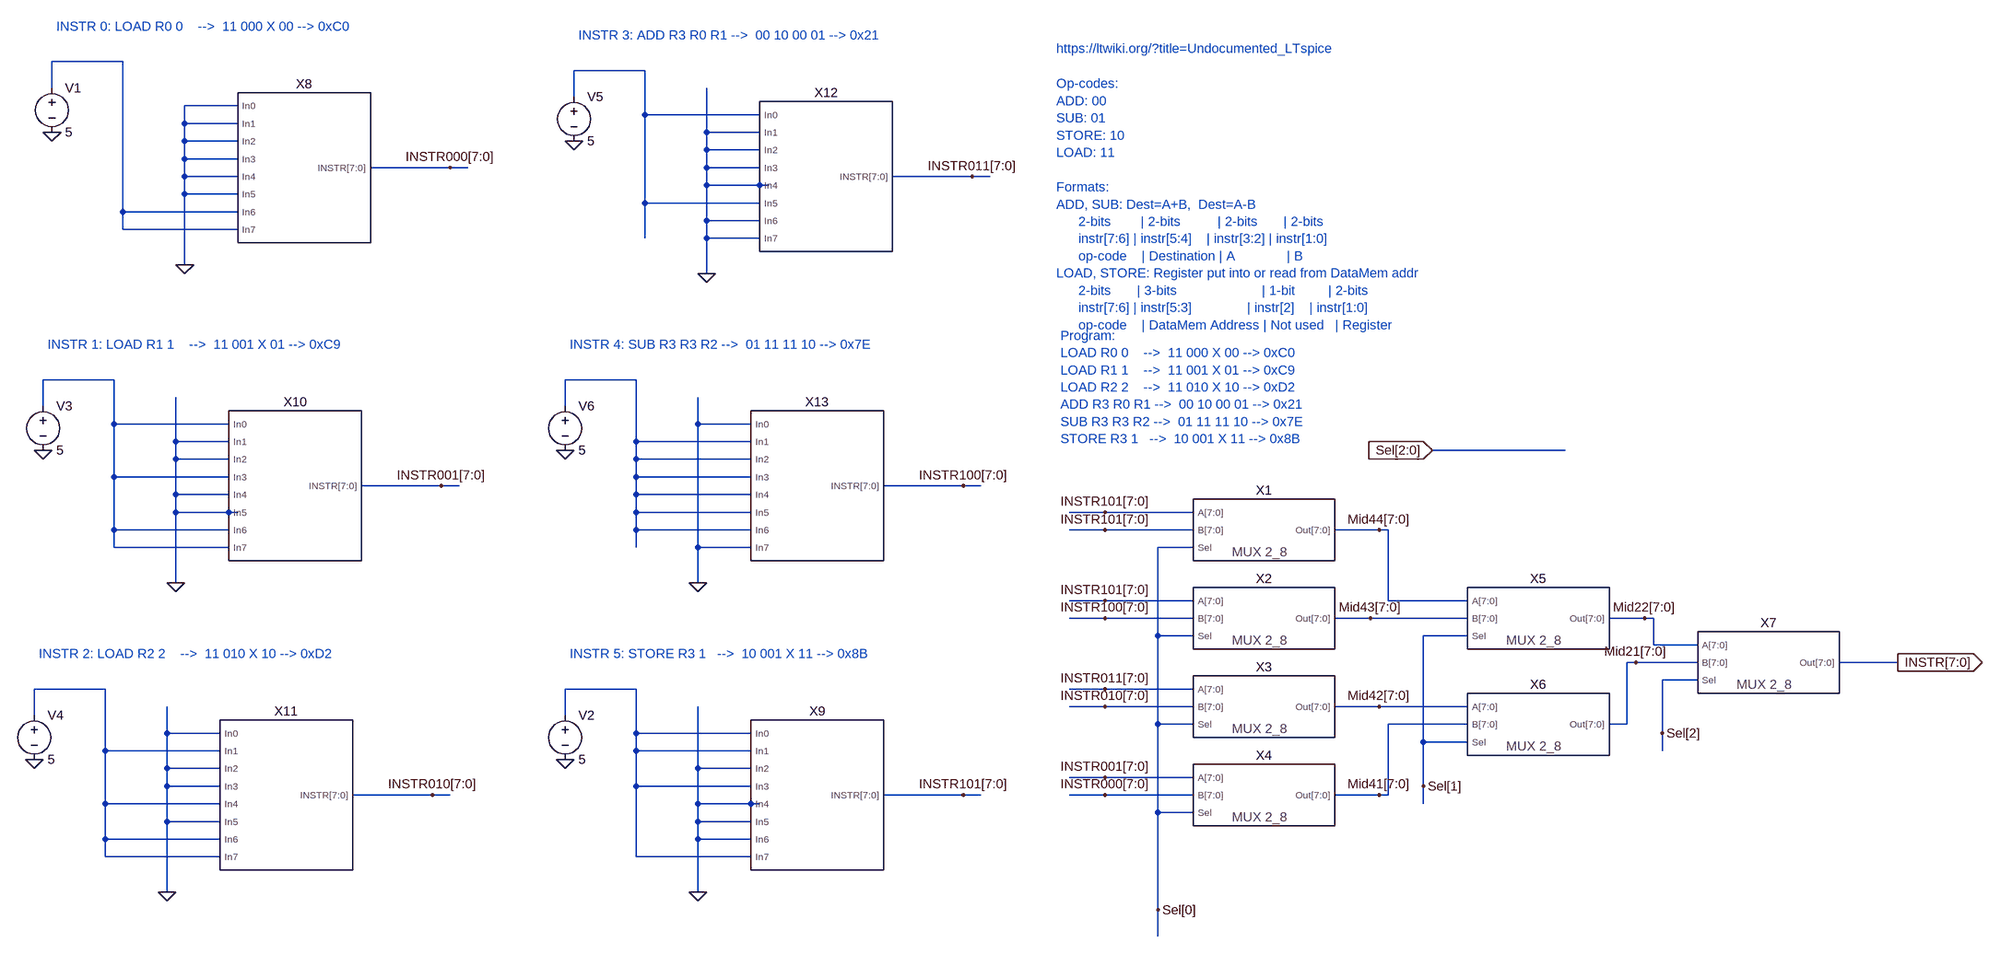
[diagram p0: schematic INSTRMEM.asc]
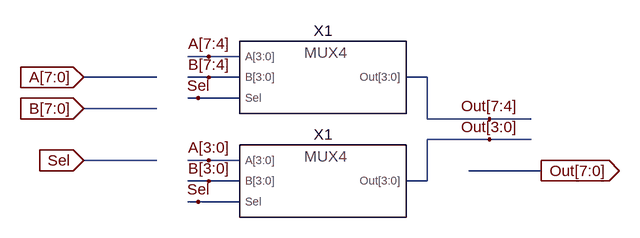
[diagram p1: sub-circuit mux2_8.asc]
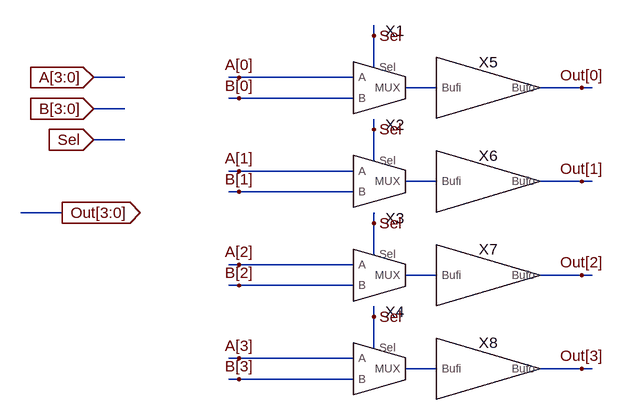
[diagram p2: sub-circuit mux4.asc]
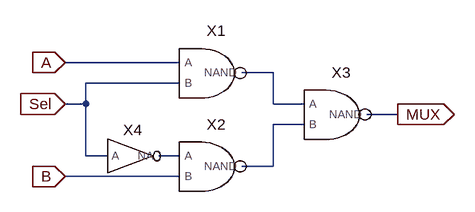
[diagram p3: sub-circuit mux.asc]
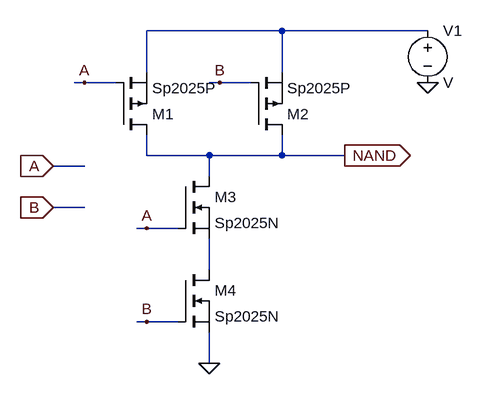
[diagram p4: sub-circuit nand.asc]
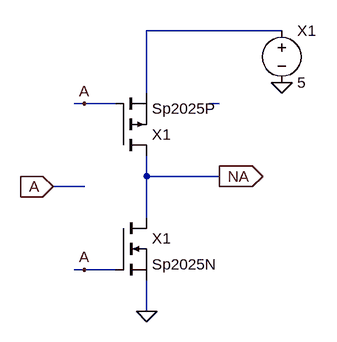
[diagram p5: sub-circuit invert.asc]
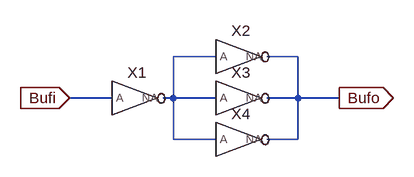
[diagram p6: sub-circuit buffer.asc]
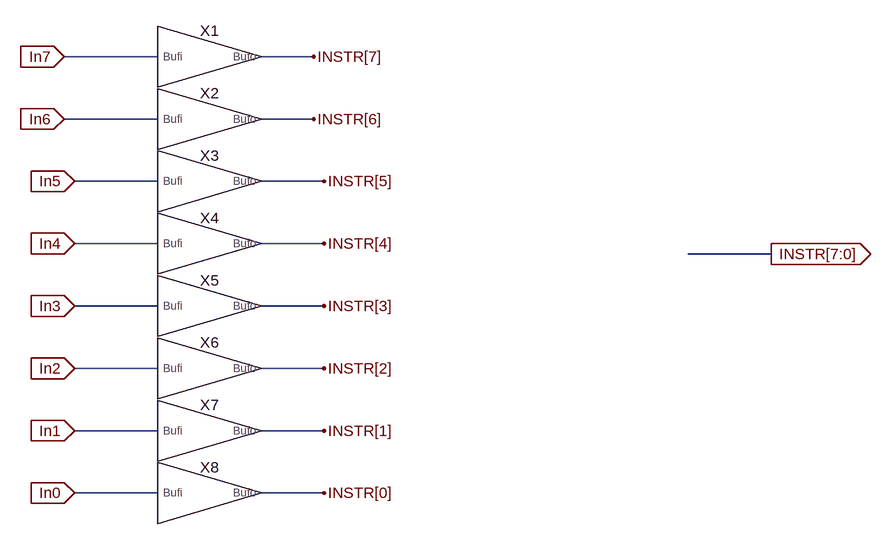
[diagram p7: sub-circuit combine8.asc]
INSTRMEM.asc, the LTspice schematic file:
Version 4
SHEET 1 880 680
WIRE -1856 -96 -1984 -96
WIRE -912 -80 -1040 -80
WIRE -1984 -48 -1984 -96
WIRE -1040 -32 -1040 -80
WIRE -1648 -16 -1744 -16
WIRE -912 0 -912 -80
WIRE -704 0 -912 0
WIRE -1744 16 -1744 -16
WIRE -1648 16 -1744 16
WIRE -800 32 -800 -48
WIRE -704 32 -800 32
WIRE -1744 48 -1744 16
WIRE -1648 48 -1744 48
WIRE -800 64 -800 32
WIRE -704 64 -800 64
WIRE -1744 80 -1744 48
WIRE -1648 80 -1744 80
WIRE -1264 96 -1408 96
WIRE -1232 96 -1264 96
WIRE -800 96 -800 64
WIRE -704 96 -800 96
WIRE -1744 112 -1744 80
WIRE -1648 112 -1744 112
WIRE -320 112 -464 112
WIRE -288 112 -320 112
WIRE -800 128 -800 96
WIRE -704 128 -800 128
WIRE -688 128 -704 128
WIRE -1744 144 -1744 112
WIRE -1648 144 -1744 144
WIRE -912 160 -912 0
WIRE -704 160 -912 160
WIRE -1856 176 -1856 -96
WIRE -1648 176 -1856 176
WIRE -800 192 -800 128
WIRE -704 192 -800 192
WIRE -1856 208 -1856 176
WIRE -1648 208 -1856 208
WIRE -912 224 -912 160
WIRE -800 224 -800 192
WIRE -704 224 -800 224
WIRE -1744 272 -1744 144
WIRE -800 288 -800 224
WIRE -1872 480 -2000 480
WIRE -928 480 -1056 480
WIRE -2000 528 -2000 480
WIRE -1056 528 -1056 480
WIRE -1872 560 -1872 480
WIRE -1664 560 -1872 560
WIRE -816 560 -816 512
WIRE -720 560 -816 560
WIRE -1760 592 -1760 512
WIRE -1664 592 -1760 592
WIRE -928 592 -928 480
WIRE -720 592 -928 592
WIRE 752 608 512 608
WIRE -1760 624 -1760 592
WIRE -1664 624 -1760 624
WIRE -928 624 -928 592
WIRE -720 624 -928 624
WIRE -1872 656 -1872 560
WIRE -1664 656 -1872 656
WIRE -928 656 -928 624
WIRE -720 656 -928 656
WIRE -1280 672 -1424 672
WIRE -1248 672 -1280 672
WIRE -336 672 -480 672
WIRE -304 672 -336 672
WIRE -1760 688 -1760 624
WIRE -1664 688 -1760 688
WIRE -928 688 -928 656
WIRE -720 688 -928 688
WIRE -1760 720 -1760 688
WIRE -1664 720 -1760 720
WIRE -1648 720 -1664 720
WIRE -928 720 -928 688
WIRE -720 720 -928 720
WIRE -80 720 -144 720
WIRE 80 720 -80 720
WIRE -1872 752 -1872 656
WIRE -1664 752 -1872 752
WIRE -928 752 -928 720
WIRE -720 752 -928 752
WIRE -80 752 -144 752
WIRE 80 752 -80 752
WIRE 416 752 336 752
WIRE 432 752 416 752
WIRE -1872 784 -1872 752
WIRE -1664 784 -1872 784
WIRE -928 784 -928 752
WIRE -816 784 -816 560
WIRE -720 784 -816 784
WIRE 80 784 16 784
WIRE -1760 848 -1760 720
WIRE -816 848 -816 784
WIRE -80 880 -144 880
WIRE 80 880 -80 880
WIRE 432 880 432 752
WIRE 576 880 432 880
WIRE -80 912 -144 912
WIRE 80 912 -80 912
WIRE 400 912 336 912
WIRE 576 912 400 912
WIRE 896 912 832 912
WIRE 912 912 896 912
WIRE 16 944 16 784
WIRE 80 944 16 944
WIRE 576 944 496 944
WIRE 912 960 912 912
WIRE 992 960 912 960
WIRE 880 992 864 992
WIRE 992 992 880 992
WIRE 1392 992 1248 992
WIRE 992 1024 928 1024
WIRE -1888 1040 -2016 1040
WIRE -928 1040 -1056 1040
WIRE -80 1040 -144 1040
WIRE 80 1040 -80 1040
WIRE -80 1072 -144 1072
WIRE 80 1072 -80 1072
WIRE 416 1072 336 1072
WIRE 576 1072 416 1072
WIRE -2016 1088 -2016 1040
WIRE -1056 1088 -1056 1040
WIRE 16 1104 16 944
WIRE 80 1104 16 1104
WIRE 576 1104 432 1104
WIRE 864 1104 864 992
WIRE 864 1104 832 1104
WIRE -1776 1120 -1776 1072
WIRE -1680 1120 -1776 1120
WIRE -928 1120 -928 1040
WIRE -720 1120 -928 1120
WIRE 928 1120 928 1024
WIRE 496 1136 496 944
WIRE 576 1136 496 1136
WIRE -1888 1152 -1888 1040
WIRE -1680 1152 -1888 1152
WIRE -928 1152 -928 1120
WIRE -720 1152 -928 1152
WIRE 928 1152 928 1120
WIRE -1776 1184 -1776 1120
WIRE -1680 1184 -1776 1184
WIRE -816 1184 -816 1072
WIRE -720 1184 -816 1184
WIRE -80 1200 -144 1200
WIRE 80 1200 -80 1200
WIRE -1776 1216 -1776 1184
WIRE -1680 1216 -1776 1216
WIRE -928 1216 -928 1152
WIRE -720 1216 -928 1216
WIRE 496 1216 496 1136
WIRE -1296 1232 -1440 1232
WIRE -1264 1232 -1296 1232
WIRE -336 1232 -480 1232
WIRE -304 1232 -336 1232
WIRE -80 1232 -144 1232
WIRE 80 1232 -80 1232
WIRE 416 1232 336 1232
WIRE 432 1232 432 1104
WIRE 432 1232 416 1232
WIRE -1888 1248 -1888 1152
WIRE -1680 1248 -1888 1248
WIRE -816 1248 -816 1184
WIRE -720 1248 -816 1248
WIRE -704 1248 -720 1248
WIRE 496 1248 496 1216
WIRE 16 1264 16 1104
WIRE 80 1264 16 1264
WIRE -1776 1280 -1776 1216
WIRE -1680 1280 -1776 1280
WIRE -816 1280 -816 1248
WIRE -720 1280 -816 1280
WIRE -1888 1312 -1888 1248
WIRE -1680 1312 -1888 1312
WIRE -816 1312 -816 1280
WIRE -720 1312 -816 1312
WIRE -1888 1344 -1888 1312
WIRE -1680 1344 -1888 1344
WIRE -928 1344 -928 1216
WIRE -720 1344 -928 1344
WIRE -1776 1408 -1776 1280
WIRE -816 1408 -816 1312
WIRE 16 1440 16 1264
WIRE 16 1488 16 1440
FLAG -1984 32 0
FLAG -1744 272 0
FLAG -1264 96 INSTR000[7:0]
FLAG -1056 1168 0
FLAG -816 1408 0
FLAG -336 1232 INSTR101[7:0]
FLAG -2000 608 0
FLAG -1760 848 0
FLAG -1280 672 INSTR001[7:0]
FLAG -2016 1168 0
FLAG -1776 1408 0
FLAG -1296 1232 INSTR010[7:0]
FLAG -1040 48 0
FLAG -800 288 0
FLAG -320 112 INSTR011[7:0]
FLAG -1056 608 0
FLAG -816 848 0
FLAG -336 672 INSTR100[7:0]
FLAG 512 608 Sel[2:0]
IOPIN 512 608 In
FLAG 1392 992 INSTR[7:0]
IOPIN 1392 992 Out
FLAG 16 1440 Sel[0]
FLAG 496 1216 Sel[1]
FLAG 928 1120 Sel[2]
FLAG -80 720 INSTR101[7:0]
FLAG -80 752 INSTR101[7:0]
FLAG -80 880 INSTR101[7:0]
FLAG -80 912 INSTR100[7:0]
FLAG -80 1040 INSTR011[7:0]
FLAG -80 1072 INSTR010[7:0]
FLAG -80 1200 INSTR001[7:0]
FLAG -80 1232 INSTR000[7:0]
FLAG 416 752 Mid44[7:0]
FLAG 400 912 Mid43[7:0]
FLAG 416 1072 Mid42[7:0]
FLAG 416 1232 Mid41[7:0]
FLAG 896 912 Mid22[7:0]
FLAG 880 992 Mid21[7:0]
SYMBOL MUX2_8 208 752 R0
SYMATTR InstName X1
SYMBOL MUX2_8 208 912 R0
SYMATTR InstName X2
SYMBOL MUX2_8 208 1072 R0
SYMATTR InstName X3
SYMBOL MUX2_8 208 1232 R0
SYMATTR InstName X4
SYMBOL MUX2_8 704 912 R0
SYMATTR InstName X5
SYMBOL MUX2_8 704 1104 R0
SYMATTR InstName X6
SYMBOL MUX2_8 1120 992 R0
SYMATTR InstName X7
SYMBOL Combine8 -1536 96 R0
SYMATTR InstName X8
SYMBOL voltage -1984 -64 R0
SYMATTR InstName V1
SYMATTR Value 5
SYMBOL Combine8 -608 1232 R0
SYMATTR InstName X9
SYMBOL voltage -1056 1072 R0
WINDOW 123 0 0 Left 0
WINDOW 39 0 0 Left 0
SYMATTR InstName V2
SYMATTR Value 5
SYMBOL Combine8 -1552 672 R0
SYMATTR InstName X10
SYMBOL voltage -2000 512 R0
WINDOW 123 0 0 Left 0
WINDOW 39 0 0 Left 0
SYMATTR InstName V3
SYMATTR Value 5
SYMBOL Combine8 -1568 1232 R0
SYMATTR InstName X11
SYMBOL voltage -2016 1072 R0
WINDOW 123 0 0 Left 0
WINDOW 39 0 0 Left 0
SYMATTR InstName V4
SYMATTR Value 5
SYMBOL Combine8 -592 112 R0
SYMATTR InstName X12
SYMBOL voltage -1040 -48 R0
WINDOW 123 0 0 Left 0
WINDOW 39 0 0 Left 0
SYMATTR InstName V5
SYMATTR Value 5
SYMBOL Combine8 -608 672 R0
SYMATTR InstName X13
SYMBOL voltage -1056 512 R0
WINDOW 123 0 0 Left 0
WINDOW 39 0 0 Left 0
SYMATTR InstName V6
SYMATTR Value 5
TEXT -168 -56 Left 2 ;Op-codes:\nADD: 00\nSUB: 01\nSTORE: 10\nLOAD: 11\n \nFormats:\nADD, SUB: Dest=A+B,  Dest=A-B\n      2-bits        | 2-bits          | 2-bits       | 2-bits\n      instr[7:6] | instr[5:4]    | instr[3:2] | instr[1:0]\n      op-code    | Destination | A              | B\nLOAD, STORE: Register put into or read from DataMem addr\n      2-bits       | 3-bits                       | 1-bit         | 2-bits\n      instr[7:6] | instr[5:3]               | instr[2]    | instr[1:0]\n      op-code    | DataMem Address | Not used   | Register
TEXT -160 400 Left 2 ;Program:\nLOAD R0 0    -->  11 000 X 00 --> 0xC0\nLOAD R1 1    -->  11 001 X 01 --> 0xC9\nLOAD R2 2    -->  11 010 X 10 --> 0xD2\nADD R3 R0 R1 -->  00 10 00 01 --> 0x21\nSUB R3 R3 R2 -->  01 11 11 10 --> 0x7E\nSTORE R3 1   -->  10 001 X 11 --> 0x8B
TEXT -168 -120 Left 2 ;https://ltwiki.org/?title=Undocumented_LTspice
TEXT -1976 -160 Left 2 ;INSTR 0: LOAD R0 0    -->  11 000 X 00 --> 0xC0
TEXT -1048 976 Left 2 ;INSTR 5: STORE R3 1   -->  10 001 X 11 --> 0x8B
TEXT -1992 416 Left 2 ;INSTR 1: LOAD R1 1    -->  11 001 X 01 --> 0xC9
TEXT -2008 976 Left 2 ;INSTR 2: LOAD R2 2    -->  11 010 X 10 --> 0xD2
TEXT -1032 -144 Left 2 ;INSTR 3: ADD R3 R0 R1 -->  00 10 00 01 --> 0x21
TEXT -1048 416 Left 2 ;INSTR 4: SUB R3 R3 R2 -->  01 11 11 10 --> 0x7E

mux2_8.asc, the sub-circuit schematic file:
Version 4
SHEET 1 880 680
WIRE 64 64 32 64
WIRE 112 64 64 64
WIRE -16 96 -128 96
WIRE 64 96 32 96
WIRE 112 96 64 96
WIRE 400 96 368 96
WIRE 48 128 32 128
WIRE 112 128 48 128
WIRE -16 144 -128 144
WIRE 400 160 400 96
WIRE 496 160 400 160
WIRE 560 160 496 160
WIRE 496 192 400 192
WIRE 560 192 496 192
WIRE -16 224 -128 224
WIRE 64 224 32 224
WIRE 112 224 64 224
WIRE 576 240 464 240
WIRE 64 256 32 256
WIRE 112 256 64 256
WIRE 400 256 400 192
WIRE 400 256 368 256
WIRE 48 288 32 288
WIRE 112 288 48 288
FLAG 48 288 Sel
FLAG 48 128 Sel
FLAG 64 64 A[7:4]
FLAG 64 96 B[7:4]
FLAG 64 224 A[3:0]
FLAG 64 256 B[3:0]
FLAG 496 160 Out[7:4]
FLAG 496 192 Out[3:0]
FLAG 576 240 Out[7:0]
IOPIN 576 240 Out
FLAG -128 96 A[7:0]
IOPIN -128 96 In
FLAG -128 144 B[7:0]
IOPIN -128 144 In
FLAG -128 224 Sel
IOPIN -128 224 In
SYMBOL MUX4 240 96 R0
SYMATTR InstName X1
SYMBOL MUX4 240 256 R0
SYMATTR InstName X1

mux4.asc, the sub-circuit schematic file:
Version 4
SHEET 1 880 680
WIRE 176 48 176 32
WIRE 176 96 176 48
WIRE -208 112 -256 112
WIRE -32 112 -48 112
WIRE 144 112 -32 112
WIRE 272 128 224 128
WIRE 496 128 432 128
WIRE 512 128 496 128
WIRE -32 144 -48 144
WIRE 144 144 -32 144
WIRE -208 160 -256 160
WIRE 176 192 176 176
WIRE -208 208 -256 208
WIRE 176 240 176 192
WIRE -32 256 -48 256
WIRE 144 256 -32 256
WIRE 272 272 224 272
WIRE 496 272 432 272
WIRE 512 272 496 272
WIRE -32 288 -48 288
WIRE 144 288 -32 288
WIRE -304 320 -368 320
WIRE 176 336 176 320
WIRE 176 384 176 336
WIRE -32 400 -48 400
WIRE 144 400 -32 400
WIRE 272 416 224 416
WIRE 496 416 432 416
WIRE 512 416 496 416
WIRE -32 432 -48 432
WIRE 144 432 -32 432
WIRE 176 480 176 464
WIRE 176 528 176 480
WIRE -32 544 -48 544
WIRE 144 544 -32 544
WIRE 272 560 224 560
WIRE 496 560 432 560
WIRE 512 560 496 560
WIRE -32 576 -48 576
WIRE 144 576 -32 576
FLAG 176 48 Sel
FLAG -256 112 A[3:0]
IOPIN -256 112 In
FLAG -256 160 B[3:0]
IOPIN -256 160 In
FLAG -256 208 Sel
IOPIN -256 208 In
FLAG -32 112 A[0]
FLAG -32 144 B[0]
FLAG 496 128 Out[0]
FLAG -304 320 Out[3:0]
IOPIN -304 320 Out
FLAG 176 192 Sel
FLAG -32 256 A[1]
FLAG -32 288 B[1]
FLAG 496 272 Out[1]
FLAG 176 336 Sel
FLAG -32 400 A[2]
FLAG -32 432 B[2]
FLAG 496 416 Out[2]
FLAG 176 480 Sel
FLAG -32 544 A[3]
FLAG -32 576 B[3]
FLAG 496 560 Out[3]
SYMBOL MUX 208 112 R0
SYMATTR InstName X1
SYMBOL MUX 208 256 R0
SYMATTR InstName X2
SYMBOL MUX 208 400 R0
SYMATTR InstName X3
SYMBOL MUX 208 544 R0
SYMATTR InstName X4
SYMBOL Buffer 352 128 R0
SYMATTR InstName X5
SYMBOL Buffer 352 272 R0
SYMATTR InstName X6
SYMBOL Buffer 352 416 R0
SYMATTR InstName X7
SYMBOL Buffer 352 560 R0
SYMATTR InstName X8

mux.asc, the sub-circuit schematic file:
Version 4
SHEET 1 880 680
WIRE 96 80 -80 80
WIRE 240 96 192 96
WIRE 96 112 -48 112
WIRE -48 144 -48 112
WIRE -48 144 -80 144
WIRE 240 144 240 96
WIRE 288 144 240 144
WIRE 432 160 384 160
WIRE 288 176 240 176
WIRE -48 224 -48 144
WIRE -16 224 -48 224
WIRE 96 224 64 224
WIRE 240 240 240 176
WIRE 240 240 192 240
WIRE 96 256 -80 256
FLAG 432 160 MUX
IOPIN 432 160 Out
FLAG -80 80 A
IOPIN -80 80 In
FLAG -80 256 B
IOPIN -80 256 In
FLAG -80 144 Sel
IOPIN -80 144 In
SYMBOL NAND 144 96 R0
SYMATTR InstName X1
SYMBOL NAND 144 240 R0
SYMATTR InstName X2
SYMBOL NAND 336 160 R0
SYMATTR InstName X3
SYMBOL INVERT 16 224 R0
SYMATTR InstName X4

nand.asc, the sub-circuit schematic file:
Version 4
SHEET 1 880 680
.lib SHEET 1 880 680
WIRE 336 -160 128 -160
WIRE 560 -160 336 -160
WIRE 128 -96 128 -160
WIRE 336 -96 336 -160
WIRE 32 -80 16 -80
WIRE 80 -80 32 -80
WIRE 240 -80 224 -80
WIRE 288 -80 240 -80
WIRE 128 32 128 0
WIRE 224 32 128 32
WIRE 336 32 336 0
WIRE 336 32 224 32
WIRE 432 32 336 32
WIRE 32 48 -16 48
WIRE 224 64 224 32
WIRE 32 112 -16 112
WIRE 128 144 112 144
WIRE 176 144 128 144
WIRE 224 208 224 160
WIRE 128 288 112 288
WIRE 176 288 128 288
WIRE 224 352 224 304
FLAG 224 352 0
FLAG -16 48 A
IOPIN -16 48 In
FLAG -16 112 B
IOPIN -16 112 In
FLAG 128 144 A
FLAG 128 288 B
FLAG 32 -80 A
FLAG 240 -80 B
FLAG 432 32 NAND
IOPIN 432 32 Out
FLAG 560 -80 0
SYMBOL pmos 80 0 M180
SYMATTR InstName M1
SYMATTR Value Sp2025P
SYMBOL pmos 288 0 M180
SYMATTR InstName M2
SYMATTR Value Sp2025P
SYMBOL nmos 176 64 R0
SYMATTR InstName M3
SYMATTR Value Sp2025N
SYMBOL nmos 176 208 R0
SYMATTR InstName M4
SYMATTR Value Sp2025N
SYMBOL voltage 560 -176 R0
SYMATTR InstName V1

invert.asc, the sub-circuit schematic file:
Version 4
SHEET 1 880 680
WIRE 352 -80 144 -80
WIRE 144 16 144 -80
WIRE 48 32 32 32
WIRE 96 32 48 32
WIRE 256 32 240 32
WIRE 144 144 144 112
WIRE 256 144 144 144
WIRE 48 160 0 160
WIRE 144 208 144 144
WIRE 48 288 32 288
WIRE 96 288 48 288
WIRE 144 352 144 304
FLAG 144 352 0
FLAG 0 160 A
IOPIN 0 160 In
FLAG 48 288 A
FLAG 48 32 A
FLAG 256 144 NA
IOPIN 256 144 Out
FLAG 352 0 0
SYMBOL pmos 96 112 M180
SYMATTR InstName X1
SYMATTR Value Sp2025P
SYMBOL nmos 96 208 R0
SYMATTR InstName X1
SYMATTR Value Sp2025N
SYMBOL voltage 352 -96 R0
SYMATTR InstName X1
SYMATTR Value 5

buffer.asc, the sub-circuit schematic file:
Version 4
SHEET 1 880 680
WIRE 224 64 160 64
WIRE 352 64 304 64
WIRE 64 128 0 128
WIRE 160 128 160 64
WIRE 160 128 144 128
WIRE 224 128 160 128
WIRE 352 128 352 64
WIRE 352 128 304 128
WIRE 416 128 352 128
WIRE 160 192 160 128
WIRE 224 192 160 192
WIRE 352 192 352 128
WIRE 352 192 304 192
FLAG 0 128 Bufi
IOPIN 0 128 In
FLAG 416 128 Bufo
IOPIN 416 128 Out
SYMBOL INVERT 96 128 R0
SYMATTR InstName X1
SYMBOL INVERT 256 64 R0
SYMATTR InstName X2
SYMBOL INVERT 256 128 R0
SYMATTR InstName X3
SYMBOL INVERT 256 192 R0
SYMATTR InstName X4

combine8.asc, the sub-circuit schematic file:
Version 4
SHEET 1 880 680
WIRE 16 128 -128 128
WIRE 256 128 176 128
WIRE 16 224 -128 224
WIRE 256 224 176 224
WIRE 16 320 -112 320
WIRE 272 320 176 320
WIRE 16 416 -112 416
WIRE 272 416 176 416
WIRE 960 432 832 432
WIRE 16 512 -112 512
WIRE 272 512 176 512
WIRE 16 608 -112 608
WIRE 272 608 176 608
WIRE 16 704 -112 704
WIRE 272 704 176 704
WIRE 16 800 -112 800
WIRE 272 800 176 800
FLAG 960 432 INSTR[7:0]
IOPIN 960 432 Out
FLAG 256 128 INSTR[7]
FLAG 256 224 INSTR[6]
FLAG 272 320 INSTR[5]
FLAG 272 416 INSTR[4]
FLAG 272 512 INSTR[3]
FLAG 272 608 INSTR[2]
FLAG 272 704 INSTR[1]
FLAG 272 800 INSTR[0]
FLAG -128 128 In7
IOPIN -128 128 In
FLAG -128 224 In6
IOPIN -128 224 In
FLAG -112 320 In5
IOPIN -112 320 In
FLAG -112 416 In4
IOPIN -112 416 In
FLAG -112 512 In3
IOPIN -112 512 In
FLAG -112 608 In2
IOPIN -112 608 In
FLAG -112 704 In1
IOPIN -112 704 In
FLAG -112 800 In0
IOPIN -112 800 In
SYMBOL Buffer 96 128 R0
SYMATTR InstName X1
SYMBOL Buffer 96 224 R0
SYMATTR InstName X2
SYMBOL Buffer 96 320 R0
SYMATTR InstName X3
SYMBOL Buffer 96 416 R0
SYMATTR InstName X4
SYMBOL Buffer 96 512 R0
SYMATTR InstName X5
SYMBOL Buffer 96 608 R0
SYMATTR InstName X6
SYMBOL Buffer 96 704 R0
SYMATTR InstName X7
SYMBOL Buffer 96 800 R0
SYMATTR InstName X8

The netlist it stands for:
* INSTRMEM.asc
XX1 INSTR101[7] INSTR101[6] INSTR101[5] INSTR101[4] INSTR101[3] INSTR101[2] INSTR101[1] INSTR101[0] INSTR101[7] INSTR101[6] INSTR101[5] INSTR101[4] INSTR101[3] INSTR101[2] INSTR101[1] INSTR101[0] Sel[0] Mid44[7] Mid44[6] Mid44[5] Mid44[4] Mid44[3] Mid44[2] Mid44[1] Mid44[0] mux2_8
XX2 INSTR101[7] INSTR101[6] INSTR101[5] INSTR101[4] INSTR101[3] INSTR101[2] INSTR101[1] INSTR101[0] INSTR100[7] INSTR100[6] INSTR100[5] INSTR100[4] INSTR100[3] INSTR100[2] INSTR100[1] INSTR100[0] Sel[0] Mid43[7] Mid43[6] Mid43[5] Mid43[4] Mid43[3] Mid43[2] Mid43[1] Mid43[0] mux2_8
XX3 INSTR011[7] INSTR011[6] INSTR011[5] INSTR011[4] INSTR011[3] INSTR011[2] INSTR011[1] INSTR011[0] INSTR010[7] INSTR010[6] INSTR010[5] INSTR010[4] INSTR010[3] INSTR010[2] INSTR010[1] INSTR010[0] Sel[0] Mid42[7] Mid42[6] Mid42[5] Mid42[4] Mid42[3] Mid42[2] Mid42[1] Mid42[0] mux2_8
XX4 INSTR001[7] INSTR001[6] INSTR001[5] INSTR001[4] INSTR001[3] INSTR001[2] INSTR001[1] INSTR001[0] INSTR000[7] INSTR000[6] INSTR000[5] INSTR000[4] INSTR000[3] INSTR000[2] INSTR000[1] INSTR000[0] Sel[0] Mid41[7] Mid41[6] Mid41[5] Mid41[4] Mid41[3] Mid41[2] Mid41[1] Mid41[0] mux2_8
XX5 Mid44[7] Mid44[6] Mid44[5] Mid44[4] Mid44[3] Mid44[2] Mid44[1] Mid44[0] Mid43[7] Mid43[6] Mid43[5] Mid43[4] Mid43[3] Mid43[2] Mid43[1] Mid43[0] Sel[1] Mid22[7] Mid22[6] Mid22[5] Mid22[4] Mid22[3] Mid22[2] Mid22[1] Mid22[0] mux2_8
XX6 Mid42[7] Mid42[6] Mid42[5] Mid42[4] Mid42[3] Mid42[2] Mid42[1] Mid42[0] Mid41[7] Mid41[6] Mid41[5] Mid41[4] Mid41[3] Mid41[2] Mid41[1] Mid41[0] Sel[1] Mid21[7] Mid21[6] Mid21[5] Mid21[4] Mid21[3] Mid21[2] Mid21[1] Mid21[0] mux2_8
XX7 Mid22[7] Mid22[6] Mid22[5] Mid22[4] Mid22[3] Mid22[2] Mid22[1] Mid22[0] Mid21[7] Mid21[6] Mid21[5] Mid21[4] Mid21[3] Mid21[2] Mid21[1] Mid21[0] Sel[2] INSTR[7] INSTR[6] INSTR[5] INSTR[4] INSTR[3] INSTR[2] INSTR[1] INSTR[0] mux2_8
XX8 0 0 0 0 0 0 N001 N001 INSTR000[7] INSTR000[6] INSTR000[5] INSTR000[4] INSTR000[3] INSTR000[2] INSTR000[1] INSTR000[0] combine8
V1 N001 0 5
XX9 N006 N006 0 N006 0 0 0 N006 INSTR101[7] INSTR101[6] INSTR101[5] INSTR101[4] INSTR101[3] INSTR101[2] INSTR101[1] INSTR101[0] combine8
V2 N006 0 5
XX10 N003 0 0 N003 0 0 N003 N003 INSTR001[7] INSTR001[6] INSTR001[5] INSTR001[4] INSTR001[3] INSTR001[2] INSTR001[1] INSTR001[0] combine8
V3 N003 0 5
XX11 0 N005 0 0 N005 0 N005 N005 INSTR010[7] INSTR010[6] INSTR010[5] INSTR010[4] INSTR010[3] INSTR010[2] INSTR010[1] INSTR010[0] combine8
V4 N005 0 5
XX12 N002 0 0 0 0 N002 0 0 INSTR011[7] INSTR011[6] INSTR011[5] INSTR011[4] INSTR011[3] INSTR011[2] INSTR011[1] INSTR011[0] combine8
V5 N002 0 5
XX13 0 N004 N004 N004 N004 N004 N004 0 INSTR100[7] INSTR100[6] INSTR100[5] INSTR100[4] INSTR100[3] INSTR100[2] INSTR100[1] INSTR100[0] combine8
V6 N004 0 5

* block symbol definitions
.subckt mux2_8 A[7] A[6] A[5] A[4] A[3] A[2] A[1] A[0] B[7] B[6] B[5] B[4] B[3] B[2] B[1] B[0] Sel Out[7] Out[6] Out[5] Out[4] Out[3] Out[2] Out[1] Out[0]
XX1 A[7] A[6] A[5] A[4] B[7] B[6] B[5] B[4] Sel Out[7] Out[6] Out[5] Out[4] mux4
XX1 A[3] A[2] A[1] A[0] B[3] B[2] B[1] B[0] Sel Out[3] Out[2] Out[1] Out[0] mux4
.ends mux2_8

.subckt mux4 A[3] A[2] A[1] A[0] B[3] B[2] B[1] B[0] Sel Out[3] Out[2] Out[1] Out[0]
XX1 A[0] B[0] Sel N001 mux
XX2 A[1] B[1] Sel N002 mux
XX3 A[2] B[2] Sel N003 mux
XX4 A[3] B[3] Sel N004 mux
XX5 N001 Out[0] buffer
XX6 N002 Out[1] buffer
XX7 N003 Out[2] buffer
XX8 N004 Out[3] buffer
.ends mux4

.subckt mux A B Sel MUX
XX1 A Sel N001 nand
XX2 N003 B N002 nand
XX3 N001 N002 MUX nand
XX4 Sel N003 invert
.ends mux

.subckt nand A B NAND
M1 NAND A N001 N001 Sp2025P
M2 NAND B N001 N001 Sp2025P
M3 NAND A N002 N002 Sp2025N
M4 N002 B 0 0 Sp2025N
V1 N001 0 V
.ends nand

.subckt invert A NA
M§X1 NA A N001 N001 Sp2025P
M§X1 NA A 0 0 Sp2025N
V§X1 N001 0 5
.ends invert

.subckt buffer Bufi Bufo
XX1 Bufi N001 invert
XX2 N001 Bufo invert
XX3 N001 Bufo invert
XX4 N001 Bufo invert
.ends buffer

.subckt combine8 In0 In1 In2 In3 In4 In5 In6 In7 INSTR[7] INSTR[6] INSTR[5] INSTR[4] INSTR[3] INSTR[2] INSTR[1] INSTR[0]
XX1 In7 INSTR[7] buffer
XX2 In6 INSTR[6] buffer
XX3 In5 INSTR[5] buffer
XX4 In4 INSTR[4] buffer
XX5 In3 INSTR[3] buffer
XX6 In2 INSTR[2] buffer
XX7 In1 INSTR[1] buffer
XX8 In0 INSTR[0] buffer
.ends combine8

.model NMOS NMOS
.model PMOS PMOS
.lib standard.mos
* Op-codes:
* ADD: 00
* SUB: 01
* STORE: 10
* LOAD: 11
* Formats:
* ADD, SUB: Dest=A+B,  Dest=A-B
*       2-bits        | 2-bits          | 2-bits       | 2-bits
*       instr[7:6] | instr[5:4]    | instr[3:2] | instr[1:0]
*       op-code    | Destination | A              | B
* LOAD, STORE: Register put into or read from DataMem addr
*       2-bits       | 3-bits                       | 1-bit         | 2-bits
*       instr[7:6] | instr[5:3]               | instr[2]    | instr[1:0]
*       op-code    | DataMem Address | Not used   | Register
* Program:
* LOAD R0 0    -->  11 000 X 00 --> 0xC0
* LOAD R1 1    -->  11 001 X 01 --> 0xC9
* LOAD R2 2    -->  11 010 X 10 --> 0xD2
* ADD R3 R0 R1 -->  00 10 00 01 --> 0x21
* SUB R3 R3 R2 -->  01 11 11 10 --> 0x7E
* STORE R3 1   -->  10 001 X 11 --> 0x8B
* https://ltwiki.org/?title=Undocumented_LTspice
* INSTR 0: LOAD R0 0    -->  11 000 X 00 --> 0xC0
* INSTR 5: STORE R3 1   -->  10 001 X 11 --> 0x8B
* INSTR 1: LOAD R1 1    -->  11 001 X 01 --> 0xC9
* INSTR 2: LOAD R2 2    -->  11 010 X 10 --> 0xD2
* INSTR 3: ADD R3 R0 R1 -->  00 10 00 01 --> 0x21
* INSTR 4: SUB R3 R3 R2 -->  01 11 11 10 --> 0x7E
.backanno
.end